# Altium schematic sheet RTU_B2_Power_Supply_Buck_Boost_Regulator.SchDoc
size A; CompanyName: Nettra; Organization: Nettra; Address1: Argentina; Address2: Frenchs Forest; Address3: NSW; Address4: Australia 2086; SheetNumber: 10; SheetTotal: 13
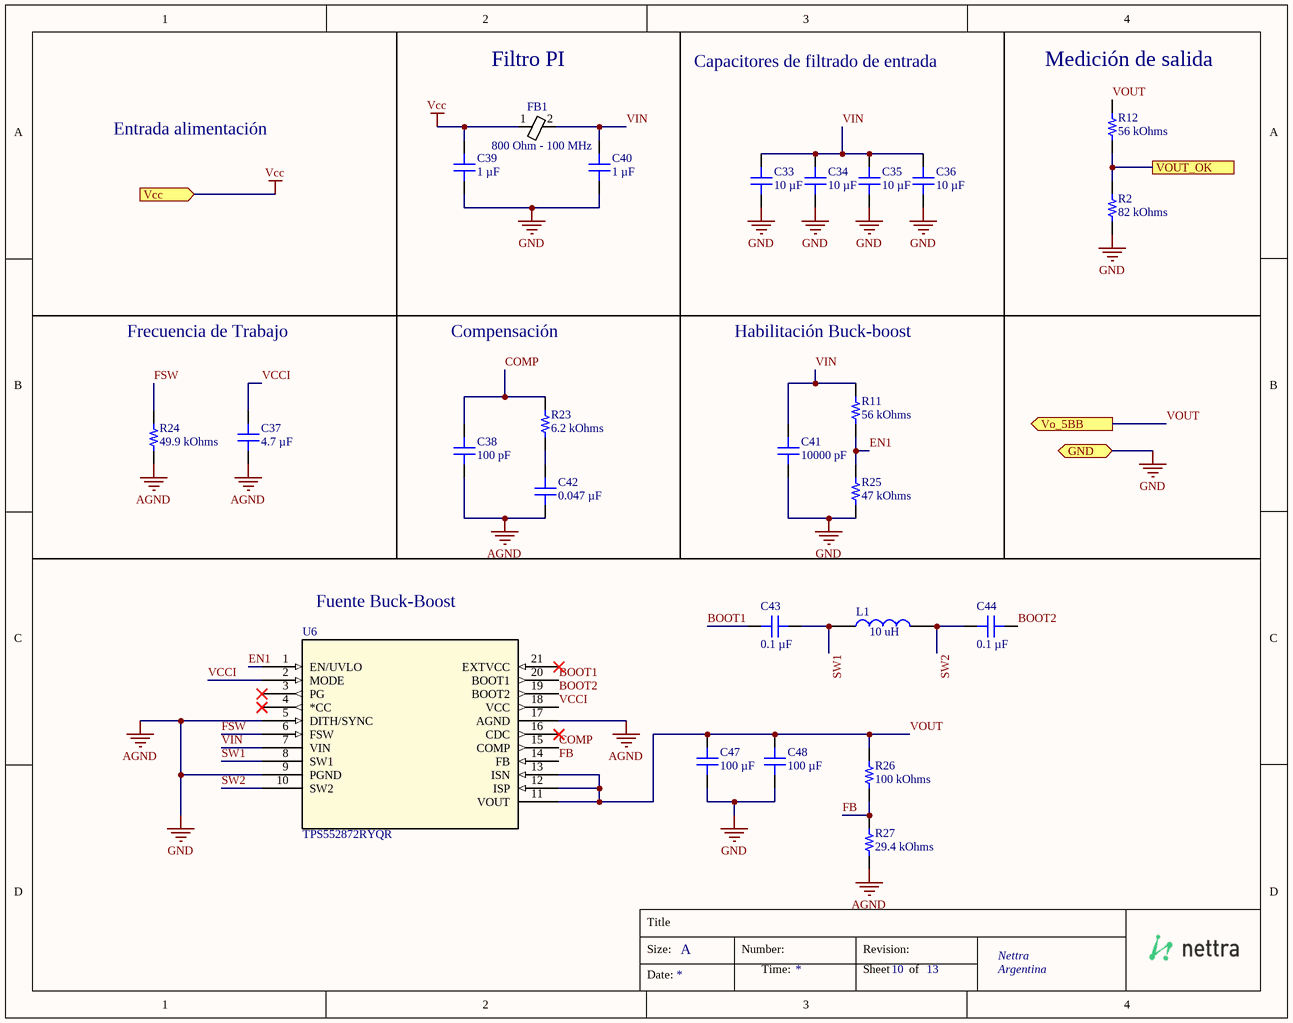
[diagram p0: RTU_B2_Power_Supply_Buck_Boost_Regulator.SchDoc]

## Parts
C33  10 µF  [CAP 1210_3225 - 1MM]
C34  10 µF  [CAP 1210_3225 - 1MM]
C35  10 µF  [CAP 1210_3225 - 1MM]
C36  10 µF  [CAP 1210_3225 - 1MM]
C37  4.7 µF  [MURATA GRM188 0603_1608]
C38  100 pF  [CAP 0603_1608]
C39  1 µF  [MURATA GRM21B 0805_2012]
C40  1 µF  [MURATA GRM21B 0805_2012]
C41  10000 pF  [CAP 0603_1608]
C42  0.047 µF  [CAP 0603_1608]
C43  0.1 µF  [CAP 0402_1005]
C44  0.1 µF  [CAP 0402_1005]
C47  100 µF  [CAP 1210_3225 - 1MM]
C48  100 µF  [CAP 1210_3225 - 1MM]
FB1  800 Ohm - 100 MHz  [BEADC5651X385N]
L1  10 uH  [SRP1038A-100M  - Inductor SMD blindado]
R2  82 kOhms  [YAGEO RES 0402_1005]
R11  56 kOhms  [YAGEO RES 0603_1608]
R12  56 kOhms  [YAGEO RES 0402_1005]
R23  6.2 kOhms  [RES 0603_1608]
R24  49.9 kOhms  [RES 0603_1608]
R25  47 kOhms  [YAGEO RES 0603_1608]
R26  100 kOhms  [RES 0603_1608]
R27  29.4 kOhms  [YAGEO RES 0603_1608]
U6  TPS552872RYQR  [VQFN21_RYQ_TEX]

## Ports
GND (bidir), Vcc (in), Vo_5BB (out), VOUT_OK

## Nets
AGND: C33.1 C34.1 C35.1 C36.1 C37.1 C38.1 C39.1 C40.1 C41.1 C42.1 C47.2 C48.2 R2.1 R24.1 R25.1 R27.1 U6.5(DITH/SYNC) U6.9(PGND) U6.17(AGND) ; port GND  [also labelled GND]
Vcc: C39.2 FB1.1 ; port Vcc
BOOT1: C43.1 U6.20(BOOT1)
BOOT2: C44.2 U6.19(BOOT2)
COMP: C38.2 R23.2 U6.15(COMP)
EN1: R11.1 R25.2 U6.1(EN/UVLO)
FB: R26.1 R27.2 U6.14(FB)
FSW: R24.2 U6.6(FSW)
SW1: C43.2 L1.1 U6.8(SW1)
SW2: C44.1 L1.2 U6.10(SW2)
VCCI: C37.2 U6.2(MODE) U6.18(VCC)
VIN: C33.2 C34.2 C35.2 C36.2 C40.2 C41.2 FB1.2 R11.2 U6.7(VIN)
VOUT: C47.1 C48.1 R12.2 R26.2 U6.11(VOUT) U6.12(ISP) U6.13(ISN) ; port Vo_5BB
VOUT_OK: R2.2 R12.1 ; port VOUT_OK
NetC42_2: C42.2 R23.1

Not connected (* = marked no-connect by the designer): U6 3(PG)* 4(*CC)* 16(CDC)* 21(EXTVCC)*

## Notes on the sheet
- Filtro PI
- Capacitores de filtrado de entrada
- (near R12) Medición de salida
- Entrada alimentación
- Frecuencia de Trabajo
- Compensación
- Habilitación Buck-boost
- Fuente Buck-Boost
- Title
- Size:
- Date:
- A
- Number:
- Time:
- Revision:
- Sheet
- of

## Library data of the parts
C33-C36 = GCJ32EC71H106KA01L: CAP CER 10UF 50V X7S 1210; manufacturer: Murata Electronics; Tolerance: ±10%; Part Number: GCJ32EC71H106KA01L; Value: 10 µF; Applications: Automotive, Boardflex Sensitive; Capacitance: 10 µF; componentlink1description: Datasheet; componentlink1url: https://search.murata.co.jp/Ceramy/image/img/A01X/G101/ENG/GCJ32EC71H106KA01-01.pdf; componentlink2description: DigiKey Link; componentlink2url: https://www.digikey.com/en/products/detail/murata-electronics/GCJ32EC71H106KA01L/6606047; Device Package: 1210 (3225 Metric); Features: Soft Termination; lastupdated: 4/6/2024 19:21:07; Lifecycle Status: Active; Minimum Order: 1; Mounting Type: Surface Mount, MLCC; Operating Temperature: -55°C ~ 125°C; Package / Case: 1210 (3225 Metric); packaging: TapeAndReel; partid: 23622; Part Status: Active; price: 0.32; Ratings: AEC-Q200; series: GCJ; Size / Dimension: 0.126" L x 0.098" W (3.20mm x 2.50mm); Supplier 1: DigiKey; Supplier Part Number 1: 490-14418-1-ND; Temperature Coefficient: X7S; Thickness (Max): 0.110" (2.80mm); Voltage - Rated: 50V
C37 = GRM188R61C475KE11D: CAP CER 4.7UF 16V X5R 0603; manufacturer: Murata Electronics; Tolerance: ±10%; Part Number: GRM188R61C475KE11D; Capacitance: 4.7 µF; Applications: General Purpose; componentlink1description: Datasheet; componentlink1url: https://search.murata.co.jp/Ceramy/image/img/A01X/G101/ENG/GRM188R61C475KE11-01.pdf; componentlink2description: DigiKey Link; componentlink2url: https://www.digikey.com/en/products/detail/murata-electronics/GRM188R61C475KE11D/4905341; Device Package: 0603 (1608 Metric); lastupdated: 20/7/2024 00:23:22; Lifecycle Status: Active; Minimum Order: 1; Mounting Type: Surface Mount, MLCC; Operating Temperature: -55°C ~ 85°C; Package / Case: 0603 (1608 Metric); packaging: TapeAndReel; partid: 2388; Part Status: Active; price: 0.03; series: GRM; Size / Dimension: 0.063" L x 0.031" W (1.60mm x 0.80mm); Supplier 1: DigiKey; Supplier Part Number 1: 490-10730-1-ND; Temperature Coefficient: X5R; Thickness (Max): 0.037" (0.95mm); value: 4.7 µF; Voltage - Rated: 16V
C38 = CL10B101KB8NFNC: CAP CER 100PF 50V X7R 0603; manufacturer: Samsung Electro-Mechanics; Tolerance: ±10%; Part Number: CL10B101KB8NFNC; Capacitance: 100 pF; Applications: General Purpose; componentlink1description: Datasheet; componentlink1url: http://www.samsungsem.com/kr/support/product-search/mlcc/CL10B101KB8NFNC.jsp; componentlink2description: DigiKey Link; componentlink2url: https://www.digikey.com/en/products/detail/samsung-electro-mechanics/CL10B101KB8NFNC/3887566; Device Package: 0603 (1608 Metric); lastupdated: 9/2/2024 20:10:28; Lifecycle Status: Active; Minimum Order: 1; Mounting Type: Surface Mount, MLCC; Operating Temperature: -55°C ~ 125°C; Package / Case: 0603 (1608 Metric); packaging: TapeAndReel; partid: 3587; Part Status: Active; price: 0.01; series: CL; Size / Dimension: 0.063" L x 0.031" W (1.60mm x 0.80mm); Supplier 1: DigiKey; Supplier Part Number 1: 1276-1908-1-ND; Temperature Coefficient: X7R; Thickness (Max): 0.035" (0.90mm); value: 100 pF; Voltage - Rated: 50V
C39 C40 = GRM21BC72A105KE01L: CAP CER 1UF 100V X7S 0805; manufacturer: Murata Electronics; Tolerance: ±10%; Part Number: GRM21BC72A105KE01L; Capacitance: 1 µF; Applications: General Purpose; componentlink1description: Datasheet; componentlink1url: https://search.murata.co.jp/Ceramy/image/img/A01X/G101/ENG/GRM21BC72A105KE01-01.pdf; componentlink2description: DigiKey Link; componentlink2url: https://www.digikey.com/en/products/detail/murata-electronics/GRM21BC72A105KE01L/6606093; Device Package: 0805 (2012 Metric); lastupdated: 27/8/2024 09:29:56; Lifecycle Status: Active; Minimum Order: 1; Mounting Type: Surface Mount, MLCC; Operating Temperature: -55°C ~ 125°C; Package / Case: 0805 (2012 Metric); packaging: TapeAndReel; partid: 8550; Part Status: Active; price: 0.06; series: GRM; Size / Dimension: 0.079" L x 0.049" W (2.00mm x 1.25mm); Supplier 1: DigiKey; Supplier Part Number 1: 490-14464-1-ND; Temperature Coefficient: X7S; Thickness (Max): 0.057" (1.45mm); value: 1 µF; Voltage - Rated: 100V
C41 = C0603C103K4REC7867: CAP CER 0603 10NF 16V X7R 10%; manufacturer: KEMET; Part Number: C0603C103K4REC7867; Capacitance: 10000 pF; Applications: ESD Protection; componentlink1description: Datasheet; componentlink1url: https://api.kemet.com/component-edge/download/datasheet/C0603C103K4REC7867.pdf; componentlink2description: DigiKey Link; componentlink2url: https://www.digikey.com/en/products/detail/kemet/C0603C103K4REC7867/8643658; Device Package: 0603 (1608 Metric); lastupdated: 9/2/2024 20:09:56; Lifecycle Status: Active; Minimum Order: 1; Mounting Type: Surface Mount, MLCC; Operating Temperature: -55°C ~ 125°C; Package / Case: 0603 (1608 Metric); packaging: TapeAndReel; partid: 34998; Part Status: Active; price: 0.01; series: ESD SMD Comm X7R; Size / Dimension: 0.063" L x 0.031" W (1.60mm x 0.80mm); Supplier 1: DigiKey; Supplier Part Number 1: 399-C0603C103K4REC7867CT-ND; Temperature Coefficient: X7R; Thickness (Max): 0.034" (0.87mm); Tolerance: ±10%; value: 10000 pF; Voltage - Rated: 16V
C42 = 885012206118: CAP CER 0.047UF 100V X7R 0603; manufacturer: Würth Elektronik; Tolerance: ±10%; Part Number: 885012206118; Value: 0.047 µF; Applications: General Purpose; Capacitance: 0.047 µF; componentlink1description: Datasheet; componentlink1url: https://katalog.we-online.de/pbs/datasheet/885012206118.pdf; componentlink2description: DigiKey Link; componentlink2url: https://www.digikey.com/en/products/detail/würth-elektronik/885012206118/9346004; Device Package: 0603 (1608 Metric); lastupdated: 10/29/2023 7:09:06 PM; Lifecycle Status: Active; Minimum Order: 1; Mounting Type: Surface Mount, MLCC; Operating Temperature: -55°C ~ 125°C; Package / Case: 0603 (1608 Metric); packaging: TapeAndReel; partid: 11891; Part Status: Active; price: 0.06; series: WCAP-CSGP; Size / Dimension: 0.063" L x 0.031" W (1.60mm x 0.80mm); Supplier 1: DigiKey; Supplier Part Number 1: 732-12192-1-ND; Temperature Coefficient: X7R; Thickness (Max): 0.037" (0.95mm); Voltage - Rated: 100V
C43 C44 = CGA2B3X5R1H104M050BB: CAP CER 0.1UF 50V X5R 0402; manufacturer: TDK Corporation; Tolerance: ±20%; Part Number: CGA2B3X5R1H104M050BB; Capacitance: 0.1 µF; Applications: Automotive; componentlink1description: Datasheet; componentlink1url: https://product.tdk.com/info/en/catalog/datasheets/mlcc_automotive_general_en.pdf?ref_disty=digikey; componentlink2description: DigiKey Link; componentlink2url: https://www.digikey.com/en/products/detail/tdk-corporation/CGA2B3X5R1H104M050BB/3949450; Device Package: 0402 (1005 Metric); lastupdated: 9/2/2024 20:04:38; Lifecycle Status: Active; Minimum Order: 1; Mounting Type: Surface Mount, MLCC; Operating Temperature: -55°C ~ 85°C; Package / Case: 0402 (1005 Metric); packaging: TapeAndReel; partid: 1792; Part Status: Active; price: 0.01; Ratings: AEC-Q200; series: CGA; Size / Dimension: 0.039" L x 0.020" W (1.00mm x 0.50mm); Supplier 1: DigiKey; Supplier Part Number 1: 445-12214-1-ND; Temperature Coefficient: X5R; Thickness (Max): 0.022" (0.55mm); value: 0.1 µF; Voltage - Rated: 50V
C47 C48 = EMK325ABJ107MM-P: CAP CER 100UF 16V X5R 1210; manufacturer: Taiyo Yuden; Tolerance: ±20%; Part Number: EMK325ABJ107MM-P; Value: 100 µF; Applications: SMPS Filtering; Capacitance: 100 µF; componentlink1description: Datasheet; componentlink1url: https://ds.yuden.co.jp/TYCOMPAS/ut/detail?pn=EMK325ABJ107MM-P &u=M; componentlink2description: DigiKey Link; componentlink2url: https://www.digikey.com/en/products/detail/taiyo-yuden/EMK325ABJ107MM-P/7067011; Device Package: 1210 (3225 Metric); lastupdated: 10/29/2023 7:38:53 PM; Lifecycle Status: Active; Minimum Order: 1; Mounting Type: Surface Mount, MLCC; Operating Temperature: -55°C ~ 85°C; Package / Case: 1210 (3225 Metric); packaging: TapeAndReel; partid: 46980; Part Status: Active; price: 0.66; series: M; Size / Dimension: 0.126" L x 0.098" W (3.20mm x 2.50mm); Supplier 1: DigiKey; Supplier Part Number 1: 587-5426-1-ND; Temperature Coefficient: X5R; Thickness (Max): 0.110" (2.80mm); Voltage - Rated: 16V
FB1 = Ferrite bead: Manufacturer_Name: Wurth Elektronik; Manufacturer_Part_Number: 7427928801; Datasheet Link: https://www.we-online.com/katalog/datasheet/7427928801.pdf; Height: 3.85mm; Mouser Part Number: 710-7427928801; Mouser Price/Stock: https://www.mouser.co.uk/ProductDetail/Wurth-Elektronik/7427928801?qs=rQFj71Wb1eXuWNYXd9UNuQ%3D%3D
L1 = SRP1038A-100M: Inductor - 10 uH - 7.5 A; Manufacturer_Name: Bourns; Datasheet Link: https://www.bourns.com/docs/Product-Datasheets/SRP1038A.pdf; Height: 4mm; Manufacturer_Part_Number: SRP1038A-100M; Mouser Part Number: 652-SRP1038A-100M; Mouser Price/Stock: https://www.mouser.co.uk/ProductDetail/Bourns/SRP1038A-100M?qs=7z%252BmIopC6%2FJQpoKC11SVQA%3D%3D; Arrow Part Number: SRP1038A-100M; Arrow Price/Stock: https://www.arrow.com/en/products/srp1038a-100m/bourns?region=nac
R2 = RC0402FR-0782KL: RES 82K OHM 1% 1/16W 0402; Manufacturer: Yageo; Power (Watts): 0.063W, 1/16W; Temperature Coefficient: ±100ppm/°C; Part Number: RC0402FR-0782KL; Value: 82 kOhms; ComponentLink1Description: Datasheet; ComponentLink1URL: https://www.yageo.com/upload/media/product/productsearch/datasheet/rchip/PYu-RC_Group_51_RoHS_L_10.pdf; ComponentLink2Description: DigiKey Link; ComponentLink2URL: https://www.digikey.com/en/products/detail/yageo/RC0402FR-0782KL/726665; Composition: Thick Film; Device Package: 0402 (1005 Metric); Features: Moisture Resistant; Height - Seated (Max): 0.016" (0.40mm); LastUpdated: 31/8/2025 15:04:18; Lifecycle Status: Active; Minimum Order: 1; Number of Terminations: 2; Operating Temperature: -55°C ~ 155°C; Package / Case: 0402 (1005 Metric); Packaging: CutTape; PartId: 2509; Part Status: Active; Price: 0.01; Resistance: 82 kOhms; Series: RC_L; Size / Dimension: 0.039" L x 0.020" W (1.00mm x 0.50mm); Supplier 1: DigiKey; Supplier Part Number 1: 311-82.0KLRCT-ND; Supplier Device Package: 0402; Tolerance: ±1%
R11 = RT0603BRD0756KL: RES SMD 56K OHM 0.1% 1/10W 0603; Manufacturer: Yageo; Power (Watts): 0.1W, 1/10W; Temperature Coefficient: ±25ppm/°C; Part Number: RT0603BRD0756KL; Value: 56 kOhms; ComponentLink1Description: Datasheet; ComponentLink1URL: https://www.yageo.com/upload/media/product/productsearch/datasheet/rchip/PYu-RT_1-to-0.01_RoHS_L_11.pdf; ComponentLink2Description: DigiKey Link; ComponentLink2URL: https://www.digikey.com/en/products/detail/yageo/RT0603BRD0756KL/1072582; Composition: Thin Film; Device Package: 0603 (1608 Metric); Height - Seated (Max): 0.022" (0.55mm); LastUpdated: 25/7/2024 09:19:30; Lifecycle Status: Active; Minimum Order: 1; Number of Terminations: 2; Operating Temperature: -55°C ~ 155°C; Package / Case: 0603 (1608 Metric); Packaging: TapeAndReel; PartId: 9254; Part Status: Active; Price: 0.03; Resistance: 56 kOhms; Series: RT; Size / Dimension: 0.063" L x 0.031" W (1.60mm x 0.80mm); Supplier 1: DigiKey; Supplier Part Number 1: YAG4576CT-ND; Supplier Device Package: 0603; Tolerance: ±0.1%
R12 = RC0402FR-0756KL: RES 56K OHM 1% 1/16W 0402; Manufacturer: Yageo; Power (Watts): 0.063W, 1/16W; Temperature Coefficient: ±100ppm/°C; Part Number: RC0402FR-0756KL; Value: 56 kOhms; ComponentLink1Description: Datasheet; ComponentLink1URL: https://www.yageo.com/upload/media/product/productsearch/datasheet/rchip/PYu-RC_Group_51_RoHS_L_10.pdf; ComponentLink2Description: DigiKey Link; ComponentLink2URL: https://www.digikey.com/en/products/detail/yageo/RC0402FR-0756KL/726635; Composition: Thick Film; Device Package: 0402 (1005 Metric); Features: Moisture Resistant; Height - Seated (Max): 0.016" (0.40mm); LastUpdated: 31/8/2025 15:04:18; Lifecycle Status: Active; Minimum Order: 1; Number of Terminations: 2; Operating Temperature: -55°C ~ 155°C; Package / Case: 0402 (1005 Metric); Packaging: CutTape; PartId: 2502; Part Status: Active; Price: 0.01; Resistance: 56 kOhms; Series: RC_L; Size / Dimension: 0.039" L x 0.020" W (1.00mm x 0.50mm); Supplier 1: DigiKey; Supplier Part Number 1: 311-56.0KLRCT-ND; Supplier Device Package: 0402; Tolerance: ±1%
R23 = TNPW06036K20BEEA: RES 6.2K OHM 0.1% 1/10W 0603; Manufacturer: Vishay Dale; Power (Watts): 0.1W, 1/10W; Temperature Coefficient: ±25ppm/°C; Part Number: TNPW06036K20BEEA; Value: 6.2 kOhms; ComponentLink1Description: Datasheet; ComponentLink1URL: http://www.vishay.com/docs/28758/tnpw_e3.pdf; ComponentLink2Description: DigiKey Link; ComponentLink2URL: https://www.digikey.com/en/products/detail/vishay-dale/TNPW06036K20BEEA/1606858; Composition: Thin Film; Device Package: 0603 (1608 Metric); Features: Anti-Sulfur, Automotive AEC-Q200, Moisture Resistant; Height - Seated (Max): 0.022" (0.55mm); LastUpdated: 9/2/2024 20:43:18; Lifecycle Status: Active; Minimum Order: 1; Number of Terminations: 2; Operating Temperature: -55°C ~ 155°C; Package / Case: 0603 (1608 Metric); Packaging: TapeAndReel; PartId: 9394; Part Status: Active; Price: 0.10; Ratings: AEC-Q200; Resistance: 6.2 kOhms; Series: TNPW e3; Size / Dimension: 0.063" L x 0.033" W (1.60mm x 0.85mm); Supplier 1: DigiKey; Supplier Part Number 1: 541-9853-1-ND; Supplier Device Package: 0603; Tolerance: ±0.1%
R24 = RCA060349K9FKEA: RES SMD 49.9K OHM 1% 1/10W 0603; Manufacturer: Vishay Dale; Power (Watts): 0.1W, 1/10W; Temperature Coefficient: ±100ppm/°C; Part Number: RCA060349K9FKEA; Value: 49.9 kOhms; ComponentLink1Description: Datasheet; ComponentLink1URL: http://www.vishay.com/docs/20037/rcae3.pdf; ComponentLink2Description: DigiKey Link; ComponentLink2URL: https://www.digikey.com/en/products/detail/vishay-dale/RCA060349K9FKEA/4946777; Composition: Thick Film; Device Package: 0603 (1608 Metric); Features: Anti-Sulfur, Automotive AEC-Q200; Height - Seated (Max): 0.020" (0.50mm); LastUpdated: 9/2/2024 20:43:29; Lifecycle Status: Active; Minimum Order: 1; Number of Terminations: 2; Operating Temperature: -55°C ~ 155°C; Package / Case: 0603 (1608 Metric); Packaging: TapeAndReel; PartId: 6647; Part Status: Active; Price: 0.01; Ratings: AEC-Q200; Resistance: 49.9 kOhms; Series: RCA; Size / Dimension: 0.061" L x 0.033" W (1.55mm x 0.85mm); Supplier 1: DigiKey; Supplier Part Number 1: 541-2208-1-ND; Supplier Device Package: 0603; Tolerance: ±1%
R25 = RT0603FRE0747KL: RES SMD 47K OHM 1% 1/10W 0603; Manufacturer: Yageo; Power (Watts): 0.1W, 1/10W; Temperature Coefficient: ±50ppm/°C; Part Number: RT0603FRE0747KL; Value: 47 kOhms; ComponentLink1Description: Datasheet; ComponentLink1URL: https://www.yageo.com/upload/media/product/productsearch/datasheet/rchip/PYu-RT_1-to-0.01_RoHS_L_11.pdf; ComponentLink2Description: DigiKey Link; ComponentLink2URL: https://www.digikey.com/en/products/detail/yageo/RT0603FRE0747KL/1075386; Composition: Thin Film; Device Package: 0603 (1608 Metric); Height - Seated (Max): 0.022" (0.55mm); LastUpdated: 25/7/2024 09:19:32; Lifecycle Status: Active; Minimum Order: 1; Number of Terminations: 2; Operating Temperature: -55°C ~ 155°C; Package / Case: 0603 (1608 Metric); Packaging: TapeAndReel; PartId: 5674; Part Status: Active; Price: 0.01; Resistance: 47 kOhms; Series: RT; Size / Dimension: 0.063" L x 0.031" W (1.60mm x 0.80mm); Supplier 1: DigiKey; Supplier Part Number 1: YAG3355CT-ND; Supplier Device Package: 0603; Tolerance: ±1%
R26 = RNCS0603BKE100K: RES 100K OHM 0.1% 1/16W 0603; Manufacturer: Stackpole Electronics Inc; Power (Watts): 0.063W, 1/16W; Temperature Coefficient: ±25ppm/°C; Part Number: RNCS0603BKE100K; Value: 100 kOhms; ComponentLink1Description: Datasheet; ComponentLink1URL: https://www.seielect.com/catalog/sei-rncs_rnch.pdf; ComponentLink2Description: DigiKey Link; ComponentLink2URL: https://www.digikey.com/en/products/detail/stackpole-electronics-inc/RNCS0603BKE100K/1708835; Composition: Thin Film; Device Package: 0603 (1608 Metric); Features: Anti-Corrosive, Automotive AEC-Q200, Moisture Resistant; Height - Seated (Max): 0.022" (0.55mm); LastUpdated: 9/2/2024 20:43:37; Lifecycle Status: Active; Minimum Order: 1; Number of Terminations: 2; Operating Temperature: -55°C ~ 155°C; Package / Case: 0603 (1608 Metric); Packaging: TapeAndReel; PartId: 4849; Part Status: Active; Price: 0.06; Ratings: AEC-Q200; Resistance: 100 kOhms; Series: RNCS; Size / Dimension: 0.061" L x 0.031" W (1.55mm x 0.80mm); Supplier 1: DigiKey; Supplier Part Number 1: RNCS0603BKE100KCT-ND; Supplier Device Package: 0603; Tolerance: ±0.1%
R27 = RT0603BRE0729K4L: RES SMD 29.4KOHM 0.1% 1/10W 0603; Manufacturer: Yageo; Power (Watts): 0.1W, 1/10W; Temperature Coefficient: ±50ppm/°C; Part Number: RT0603BRE0729K4L; Value: 29.4 kOhms; ComponentLink1Description: Datasheet; ComponentLink1URL: https://www.yageo.com/upload/media/product/productsearch/datasheet/rchip/PYu-RT_1-to-0.01_RoHS_L_11.pdf; ComponentLink2Description: DigiKey Link; ComponentLink2URL: https://www.digikey.com/en/products/detail/yageo/RT0603BRE0729K4L/1072934; Composition: Thin Film; Device Package: 0603 (1608 Metric); Height - Seated (Max): 0.022" (0.55mm); LastUpdated: 25/7/2024 09:19:26; Lifecycle Status: Active; Minimum Order: 1; Number of Terminations: 2; Operating Temperature: -55°C ~ 155°C; Package / Case: 0603 (1608 Metric); Packaging: TapeAndReel; PartId: 15520; Part Status: Active; Price: 0.04; Resistance: 29.4 kOhms; Series: RT; Size / Dimension: 0.063" L x 0.031" W (1.60mm x 0.80mm); Supplier 1: DigiKey; Supplier Part Number 1: YAG4681CT-ND; Supplier Device Package: 0603; Tolerance: ±0.1%
U6 = TPS552872RYQR: 36-V, 4-A fully integrated buck-boost converter 21-VQFN-HR -40 to 125; Manufacturer_Name: Texas Instruments; Copyright: Copyright (C) 2025 Ultra Librarian. All rights reserved.; Manufacturer_Part_Number: TPS552872RYQR; RefDes: RefDes; Type: Type